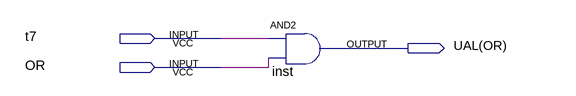
[diagram p0: schematic sheet]
// Quartus schematic UAL(OR).bdf as structural Verilog: 1 symbols, 3 pins
module \UAL(OR)  (
  input  t7,
  input  OR,
  output \UAL(OR) 
);

  and inst (\UAL(OR) , t7, OR);
endmodule
